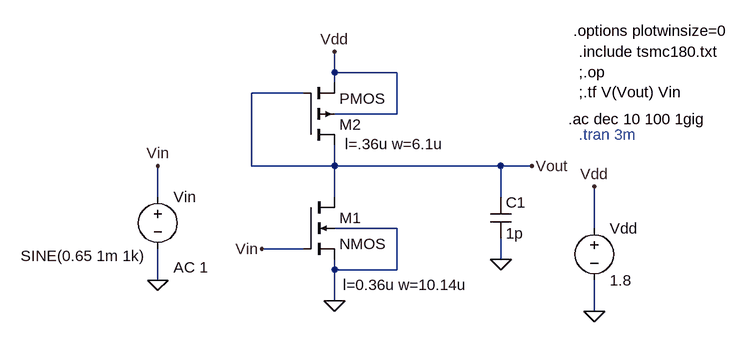
[diagram p0: schematic COMMON SOURCE AMPLIFIER WITH A DIODE CONNECTED LOAD0.asc]
COMMON SOURCE AMPLIFIER WITH A DIODE CONNECTED LOAD0.asc, the LTspice schematic file:
Version 4
SHEET 1 880 680
WIRE 192 16 192 -16
WIRE 288 16 192 16
WIRE 192 32 192 16
WIRE 144 48 64 48
WIRE 288 80 288 16
WIRE 288 80 192 80
WIRE 64 160 64 48
WIRE 192 160 192 128
WIRE 192 160 64 160
WIRE 448 160 192 160
WIRE 496 160 448 160
WIRE -80 208 -80 160
WIRE 192 208 192 160
WIRE 448 208 448 160
WIRE 288 256 192 256
WIRE 592 256 592 192
WIRE 144 288 80 288
WIRE 448 304 448 272
WIRE 192 320 192 304
WIRE 288 320 288 256
WIRE 288 320 192 320
WIRE -80 336 -80 288
WIRE 192 368 192 320
WIRE 592 384 592 336
FLAG -80 336 0
FLAG 192 368 0
FLAG 592 384 0
FLAG 80 288 Vin
FLAG 592 192 Vdd
FLAG 192 -16 Vdd
FLAG -80 160 Vin
FLAG 448 304 0
FLAG 496 160 Vout
SYMBOL pmos4 144 128 M180
WINDOW 123 64 2 Left 2
SYMATTR Value2 l=.36u w=6.1u
SYMATTR InstName M2
SYMBOL nmos4 144 208 R0
WINDOW 123 61 135 Left 2
SYMATTR Value2 l=0.36u w=10.14u
SYMATTR InstName M1
SYMBOL voltage 592 240 R0
WINDOW 123 0 0 Left 0
WINDOW 39 0 0 Left 0
SYMATTR InstName Vdd
SYMATTR Value 1.8
SYMBOL voltage -80 192 R0
WINDOW 3 -211 107 Left 2
WINDOW 123 24 124 Left 2
WINDOW 39 0 0 Left 0
SYMATTR Value SINE(0.65 1m 1k)
SYMATTR Value2 AC 1
SYMATTR InstName Vin
SYMBOL cap 432 208 R0
SYMATTR InstName C1
SYMATTR Value 1p
TEXT 568 -16 Left 2 !.include tsmc180.txt\n;.op\n;.tf V(Vout) Vin
TEXT 552 88 Left 2 !.ac dec 10 100 1gig
TEXT 568 112 Left 2 ;.tran 3m
TEXT 560 -48 Left 2 !.options plotwinsize=0

The netlist it stands for:
* COMMON SOURCE AMPLIFIER WITH A DIODE CONNECTED LOAD0.asc
M2 Vout Vout Vdd Vdd PMOS l=.36u w=6.1u
M1 Vout Vin 0 0 NMOS l=0.36u w=10.14u
Vdd Vdd 0 1.8
Vin Vin 0 SINE(0.65 1m 1k) AC 1
C1 Vout 0 1p
.model NMOS NMOS
.model PMOS PMOS
.lib standard.mos
.include tsmc180.txt
;.op
;.tf V(Vout) Vin
.ac dec 10 100 1gig
* .tran 3m
.options plotwinsize=0
.backanno
.end